# EAGLE design GALI (EAGLE 7.4.0)
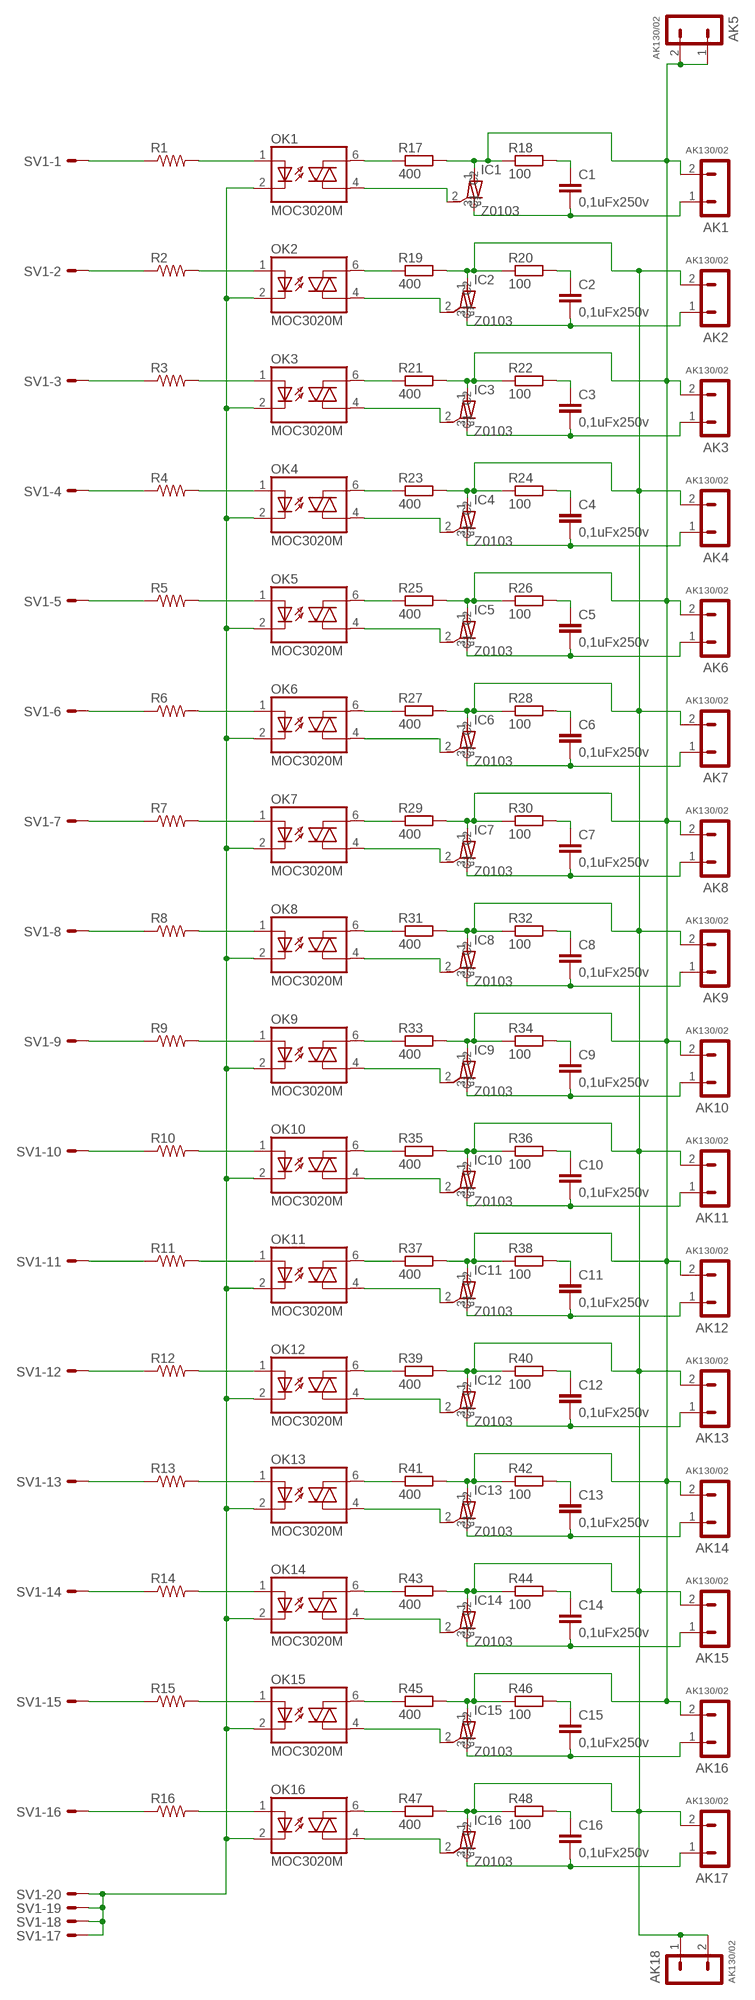
[diagram p0: schematic, sheet 1]

## Parts
AK1  AK130/02  [AK02]
AK2  AK130/02  [AK02]
AK3  AK130/02  [AK02]
AK4  AK130/02  [AK02]
AK5  AK130/02  [AK02]
AK6  AK130/02  [AK02]
AK7  AK130/02  [AK02]
AK8  AK130/02  [AK02]
AK9  AK130/02  [AK02]
AK10  AK130/02  [AK02]
AK11  AK130/02  [AK02]
AK12  AK130/02  [AK02]
AK13  AK130/02  [AK02]
AK14  AK130/02  [AK02]
AK15  AK130/02  [AK02]
AK16  AK130/02  [AK02]
AK17  AK130/02  [AK02]
AK18  AK130/02  [AK02]
C1  0,1uFx250v  C-EU102-054X133  [C102-054X133]
C2  0,1uFx250v  C-EU102-054X133  [C102-054X133]
C3  0,1uFx250v  C-EU102-054X133  [C102-054X133]
C4  0,1uFx250v  C-EU102-054X133  [C102-054X133]
C5  0,1uFx250v  C-EU102-054X133  [C102-054X133]
C6  0,1uFx250v  C-EU102-054X133  [C102-054X133]
C7  0,1uFx250v  C-EU102-054X133  [C102-054X133]
C8  0,1uFx250v  C-EU102-054X133  [C102-054X133]
C9  0,1uFx250v  C-EU102-054X133  [C102-054X133]
C10  0,1uFx250v  C-EU102-054X133  [C102-054X133]
C11  0,1uFx250v  C-EU102-054X133  [C102-054X133]
C12  0,1uFx250v  C-EU102-054X133  [C102-054X133]
C13  0,1uFx250v  C-EU102-054X133  [C102-054X133]
C14  0,1uFx250v  C-EU102-054X133  [C102-054X133]
C15  0,1uFx250v  C-EU102-054X133  [C102-054X133]
C16  0,1uFx250v  C-EU102-054X133  [C102-054X133]
IC1  Z0103  [TO92-]
IC2  Z0103  [TO92-]
IC3  Z0103  [TO92-]
IC4  Z0103  [TO92-]
IC5  Z0103  [TO92-]
IC6  Z0103  [TO92-]
IC7  Z0103  [TO92-]
IC8  Z0103  [TO92-]
IC9  Z0103  [TO92-]
IC10  Z0103  [TO92-]
IC11  Z0103  [TO92-]
IC12  Z0103  [TO92-]
IC13  Z0103  [TO92-]
IC14  Z0103  [TO92-]
IC15  Z0103  [TO92-]
IC16  Z0103  [TO92-]
OK1  MOC3020M  [DIL06]
OK2  MOC3020M  [DIL06]
OK3  MOC3020M  [DIL06]
OK4  MOC3020M  [DIL06]
OK5  MOC3020M  [DIL06]
OK6  MOC3020M  [DIL06]
OK7  MOC3020M  [DIL06]
OK8  MOC3020M  [DIL06]
OK9  MOC3020M  [DIL06]
OK10  MOC3020M  [DIL06]
OK11  MOC3020M  [DIL06]
OK12  MOC3020M  [DIL06]
OK13  MOC3020M  [DIL06]
OK14  MOC3020M  [DIL06]
OK15  MOC3020M  [DIL06]
OK16  MOC3020M  [DIL06]
R1  R-US_0207/12  [0207/12]
R2  R-US_0207/12  [0207/12]
R3  R-US_0207/12  [0207/12]
R4  R-US_0207/12  [0207/12]
R5  R-US_0207/12  [0207/12]
R6  R-US_0207/12  [0207/12]
R7  R-US_0207/12  [0207/12]
R8  R-US_0207/12  [0207/12]
R9  R-US_0207/12  [0207/12]
R10  R-US_0207/12  [0207/12]
R11  R-US_0207/12  [0207/12]
R12  R-US_0207/12  [0207/12]
R13  R-US_0207/12  [0207/12]
R14  R-US_0207/12  [0207/12]
R15  R-US_0207/12  [0207/12]
R16  R-US_0207/12  [0207/12]
R17  400  R-EU_0613/15  [P0613/15]
R18  100  R-EU_0613/15  [P0613/15]
R19  400  R-EU_0613/15  [P0613/15]
R20  100  R-EU_0613/15  [P0613/15]
R21  400  R-EU_0613/15  [P0613/15]
R22  100  R-EU_0613/15  [P0613/15]
R23  400  R-EU_0613/15  [P0613/15]
R24  100  R-EU_0613/15  [P0613/15]
R25  400  R-EU_0613/15  [P0613/15]
R26  100  R-EU_0613/15  [P0613/15]
R27  400  R-EU_0613/15  [P0613/15]
R28  100  R-EU_0613/15  [P0613/15]
R29  400  R-EU_0613/15  [P0613/15]
R30  100  R-EU_0613/15  [P0613/15]
R31  400  R-EU_0613/15  [P0613/15]
R32  100  R-EU_0613/15  [P0613/15]
R33  400  R-EU_0613/15  [P0613/15]
R34  100  R-EU_0613/15  [P0613/15]
R35  400  R-EU_0613/15  [P0613/15]
R36  100  R-EU_0613/15  [P0613/15]
R37  400  R-EU_0613/15  [P0613/15]
R38  100  R-EU_0613/15  [P0613/15]
R39  400  R-EU_0613/15  [P0613/15]
R40  100  R-EU_0613/15  [P0613/15]
R41  400  R-EU_0613/15  [P0613/15]
R42  100  R-EU_0613/15  [P0613/15]
R43  400  R-EU_0613/15  [P0613/15]
R44  100  R-EU_0613/15  [P0613/15]
R45  400  R-EU_0613/15  [P0613/15]
R46  100  R-EU_0613/15  [P0613/15]
R47  400  R-EU_0613/15  [P0613/15]
R48  100  R-EU_0613/15  [P0613/15]
SV1  ML20E  [ML20]

## Nets
N$1: R1.1 SV1.1
N$2: OK2.1(A) R2.2
N$3: OK3.1(A) R3.2
N$4: OK4.1(A) R4.2
N$5: OK5.1(A) R5.2
N$6: OK6.1(A) R6.2
N$7: OK7.1(A) R7.2
N$8: OK8.1(A) R8.2
N$9: OK9.1(A) R9.2
N$10: OK10.1(A) R10.2
N$11: OK11.1(A) R11.2
N$12: OK12.1(A) R12.2
N$13: OK13.1(A) R13.2
N$14: OK14.1(A) R14.2
N$15: OK15.1(A) R15.2
N$16: R2.1 SV1.2
N$17: OK1.2(C) OK2.2(C) OK3.2(C) OK4.2(C) OK5.2(C) OK6.2(C) OK7.2(C) OK8.2(C) OK9.2(C) OK10.2(C) OK11.2(C) OK12.2(C) OK13.2(C) OK14.2(C) OK15.2(C) OK16.2(C) SV1.17 SV1.18 SV1.19 SV1.20
N$18: OK1.1(A) R1.2
N$19: R3.1 SV1.3
N$20: R4.1 SV1.4
N$21: R5.1 SV1.5
N$22: R6.1 SV1.6
N$23: R7.1 SV1.7
N$24: R8.1 SV1.8
N$25: R9.1 SV1.9
N$26: R10.1 SV1.10
N$27: R11.1 SV1.11
N$28: R12.1 SV1.12
N$29: R13.1 SV1.13
N$30: R14.1 SV1.14
N$31: R15.1 SV1.15
N$32: R16.1 SV1.16
N$33: OK16.1(A) R16.2
N$34: OK1.6(A2) R17.1
N$35: OK2.6(A2) R19.1
N$36: OK3.6(A2) R21.1
N$37: OK4.6(A2) R23.1
N$38: OK5.6(A2) R25.1
N$39: OK6.6(A2) R27.1
N$40: OK7.6(A2) R29.1
N$41: OK8.6(A2) R31.1
N$42: OK9.6(A2) R33.1
N$43: OK10.6(A2) R35.1
N$44: OK11.6(A2) R37.1
N$45: OK12.6(A2) R39.1
N$46: OK13.6(A2) R41.1
N$47: OK14.6(A2) R43.1
N$48: OK15.6(A2) R45.1
N$49: OK16.6(A2) R47.1
N$50: C3.1 R22.2
N$51: IC1.2(G) OK1.4(A1)
N$52: C2.1 R20.2
N$53: IC2.2(G) OK2.4(A1)
N$54: C1.1 R18.2
N$55: IC3.2(G) OK3.4(A1)
N$56: C6.1 R28.2
N$57: IC4.2(G) OK4.4(A1)
N$58: C5.1 R26.2
N$59: IC5.2(G) OK5.4(A1)
N$60: C4.1 R24.2
N$61: IC6.2(G) OK6.4(A1)
N$62: C7.1 R30.2
N$63: IC7.2(G) OK7.4(A1)
N$64: C8.1 R32.2
N$65: IC8.2(G) OK8.4(A1)
N$67: IC9.2(G) OK9.4(A1)
N$68: AK1.2 AK3.2 AK5.1 AK5.2 AK6.2 AK8.2 AK10.2 AK12.2 AK14.2 AK16.2 IC1.1(C1) IC3.1(C1) IC5.1(C1) IC7.1(C1) IC9.1(C1) IC11.1(C1) IC13.1(C1) IC15.1(C1) R17.2 R18.1 R21.2 R22.1 R25.2 R26.1 R29.2 R30.1 R33.2 R34.1 R37.2 R38.1 R41.2 R42.1 R45.2 R46.1
N$69: IC10.2(G) OK10.4(A1)
N$71: IC11.2(G) OK11.4(A1)
N$72: C10.1 R36.2
N$73: IC12.2(G) OK12.4(A1)
N$74: C14.1 R44.2
N$75: IC13.2(G) OK13.4(A1)
N$76: C13.1 R42.2
N$77: IC14.2(G) OK14.4(A1)
N$78: C15.1 R46.2
N$79: IC15.2(G) OK15.4(A1)
N$80: C16.1 R48.2
N$81: IC16.2(G) OK16.4(A1)
N$83: AK1.1 C1.2 IC1.3(C2)
N$85: AK2.1 C2.2 IC2.3(C2)
N$87: AK3.1 C3.2 IC3.3(C2)
N$89: AK4.1 C4.2 IC4.3(C2)
N$91: AK6.1 C5.2 IC5.3(C2)
N$93: AK7.1 C6.2 IC6.3(C2)
N$94: C11.1 R38.2
N$95: AK8.1 C7.2 IC7.3(C2)
N$96: C12.1 R40.2
N$97: AK9.1 C8.2 IC8.3(C2)
N$98: C9.1 R34.2
N$99: AK10.1 C9.2 IC9.3(C2)
N$101: AK11.1 C10.2 IC10.3(C2)
N$103: AK12.1 C11.2 IC11.3(C2)
N$105: AK13.1 C12.2 IC12.3(C2)
N$107: AK14.1 C13.2 IC13.3(C2)
N$109: AK15.1 C14.2 IC14.3(C2)
N$111: AK16.1 C15.2 IC15.3(C2)
N$112: AK2.2 AK4.2 AK7.2 AK9.2 AK11.2 AK13.2 AK15.2 AK17.2 AK18.1 AK18.2 IC2.1(C1) IC4.1(C1) IC6.1(C1) IC8.1(C1) IC10.1(C1) IC12.1(C1) IC14.1(C1) IC16.1(C1) R19.2 R20.1 R23.2 R24.1 R27.2 R28.1 R31.2 R32.1 R35.2 R36.1 R39.2 R40.1 R43.2 R44.1 R47.2 R48.1
N$113: AK17.1 C16.2 IC16.3(C2)

## Library data of the parts
AK1-AK18 = ptr_ak130:AK130/02: ANSCHLUSSKLEMME AK130 (2POLIG)
C1-C16 = rcl:C-EU: CAPACITOR, European symbol
IC1-IC16 = Z0103MA triac:Z0103: edit this description Auto generated by make-symbol-device-package-bsdl.ulp Rev. 44 Source:
OK1-OK16 = optocoupler-2:MOC30*M: RANDOM-PHASE OPTOISOLATORS TRIAC DRIVER OUTPUT Source: http://www.fairchildsemi.com MOC3020-M.pdf
R1-R16 = resistor:R-US_: RESISTOR, American symbol
R17-R48 = rcl:R-EU_: RESISTOR, European symbol
SV1 = con-harting-ml:ML20?E: HARTING

## Board
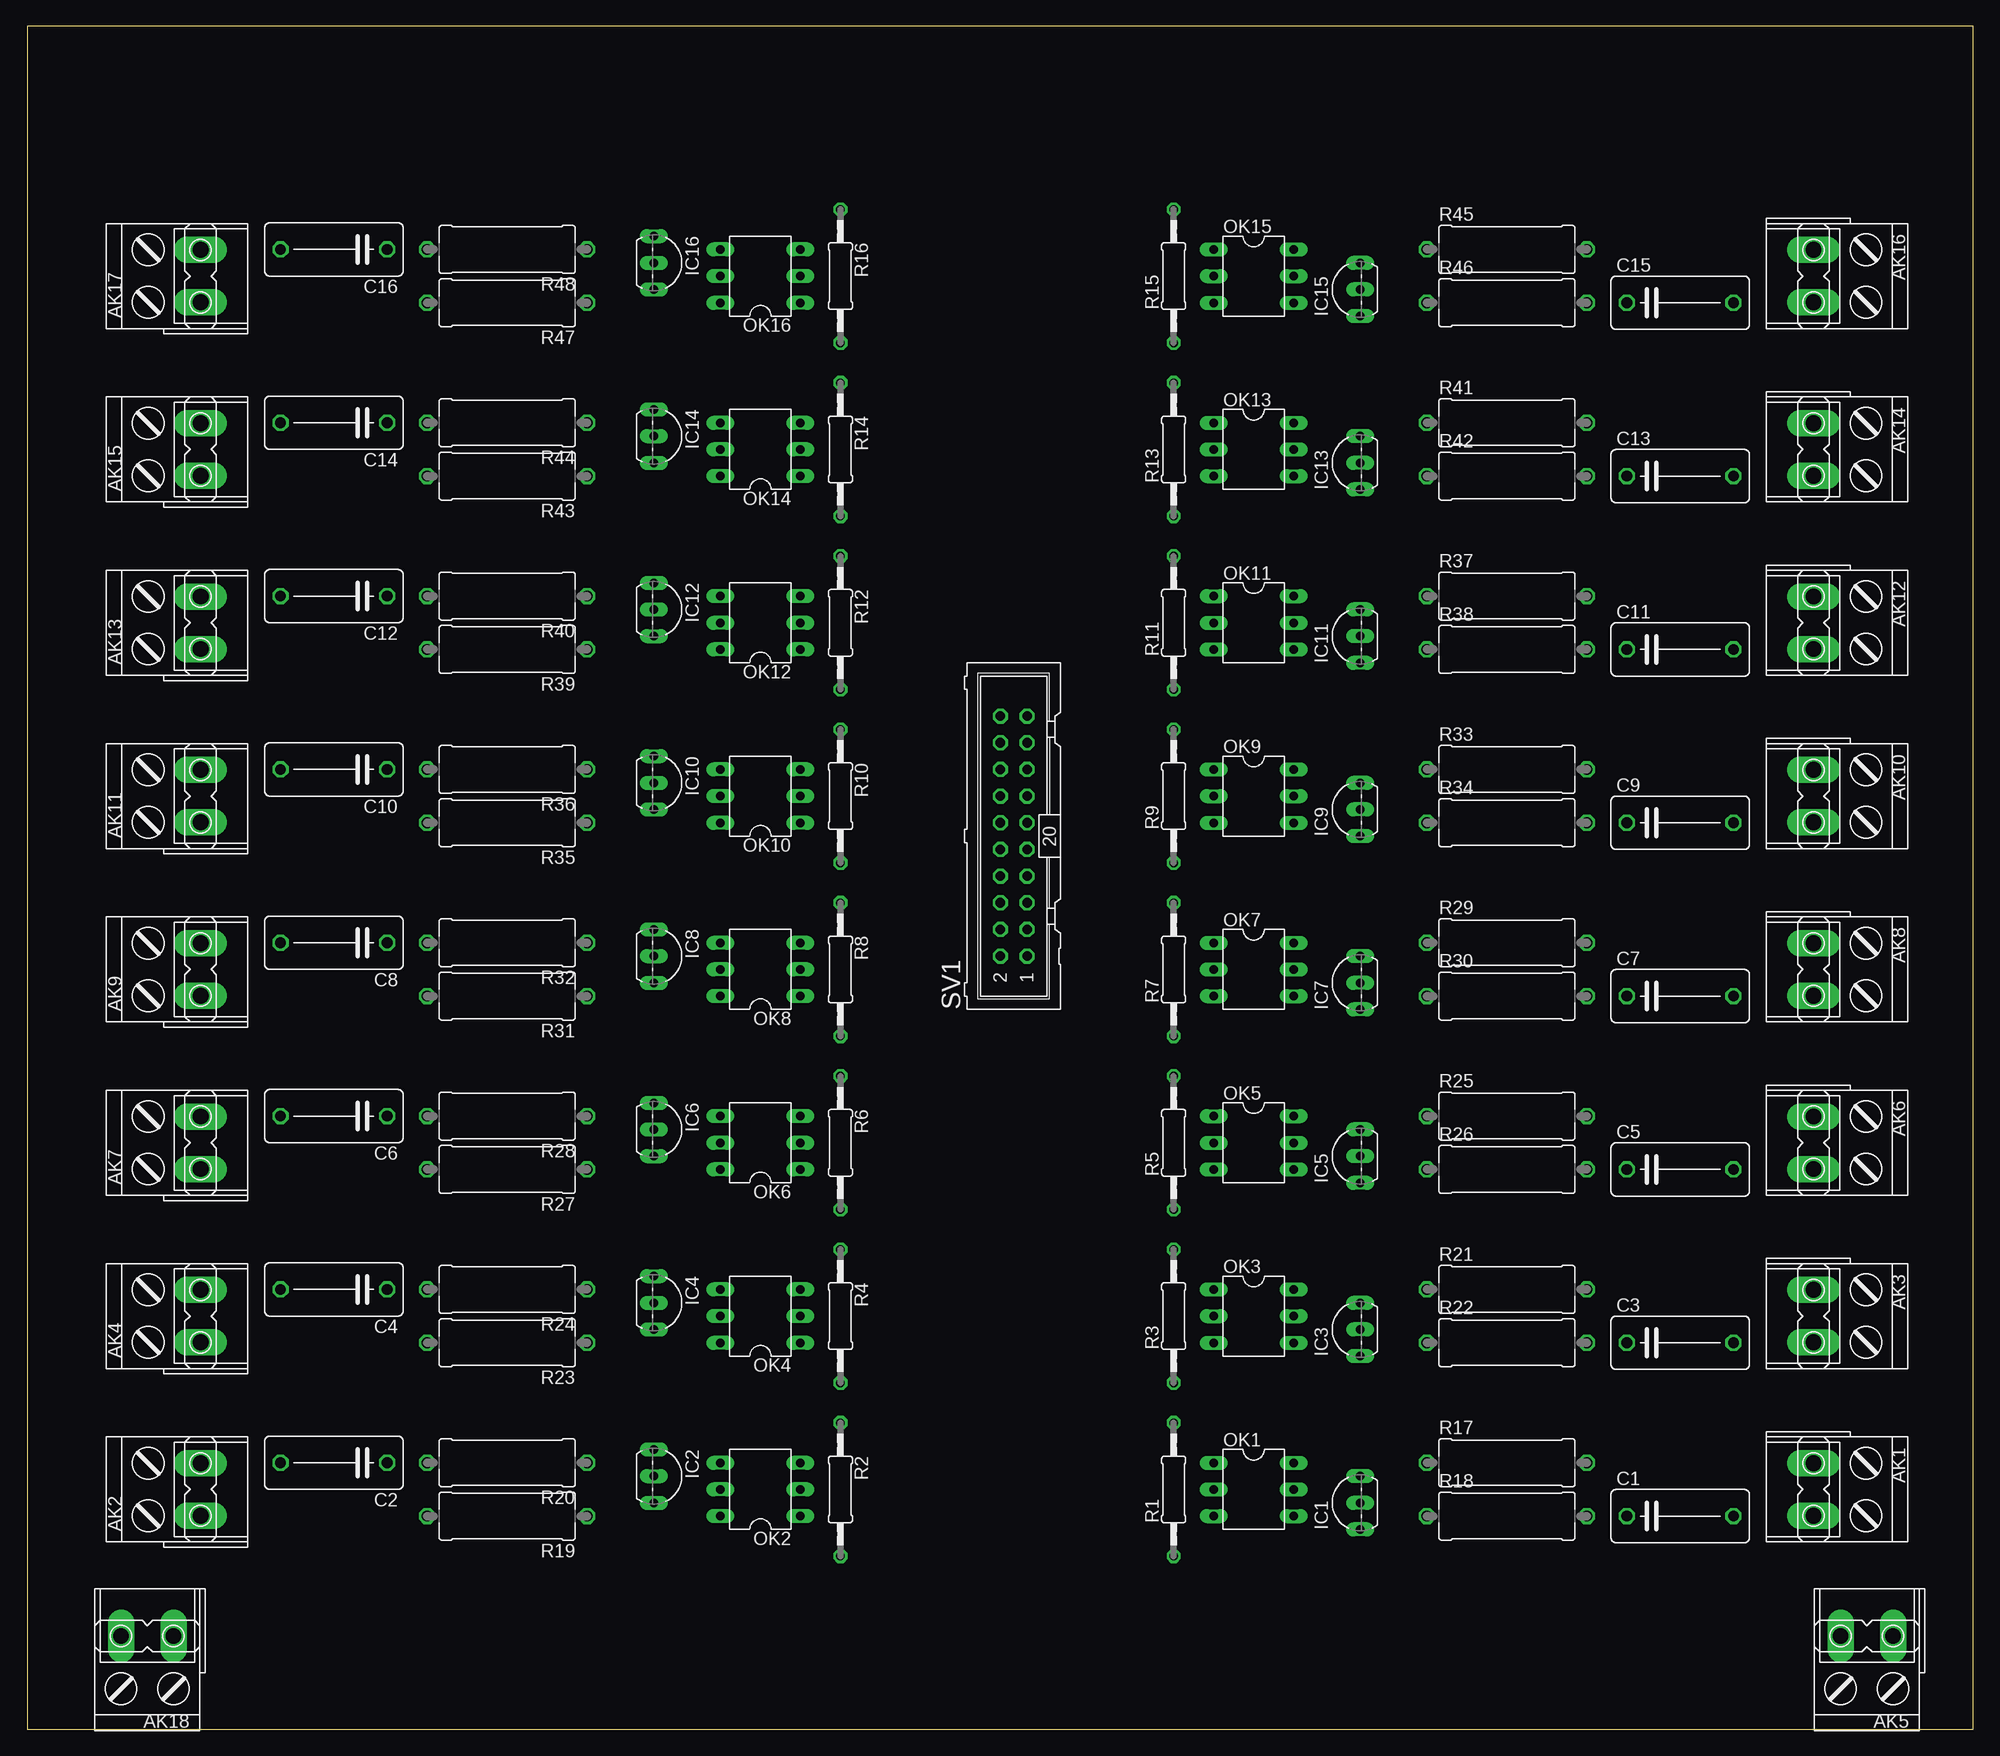
[diagram p1: board, top side]
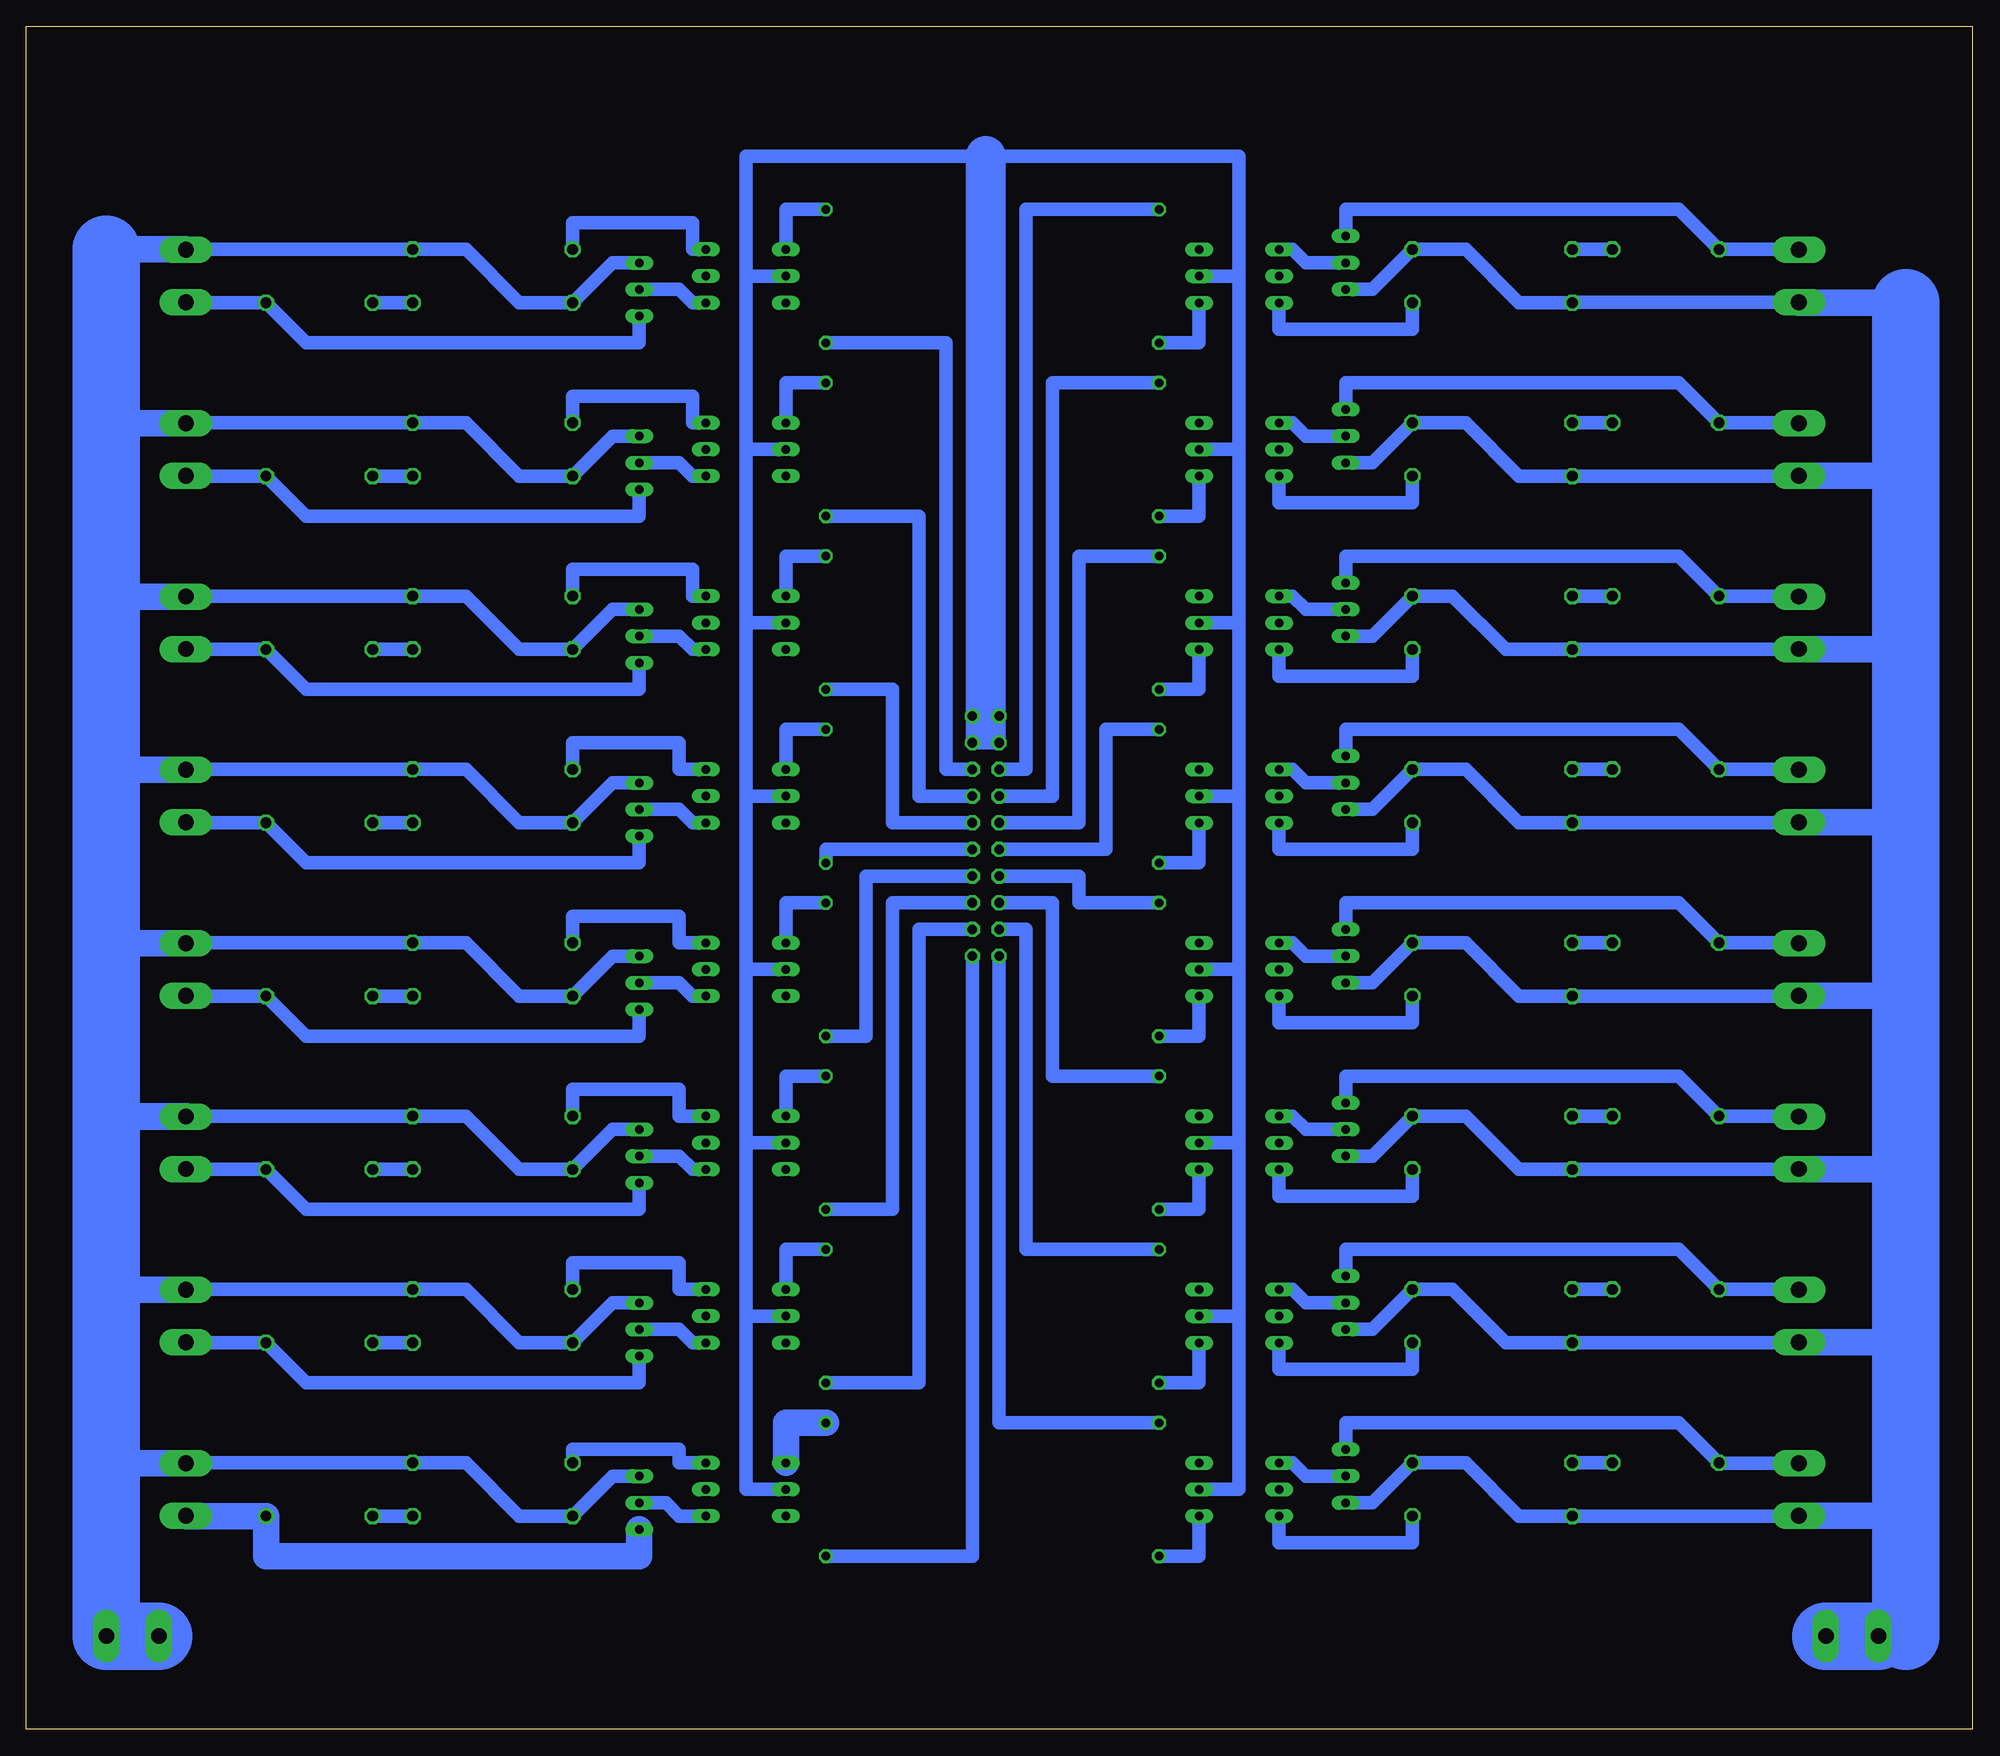
[diagram p2: board, bottom side, seen from below]

Size 185.4 x 162.23 mm. Coordinates in mm from the lower left corner, seen from the top.
Outline: 0,0 185.4,0 185.4,162.23 0,162.23 0,0
Copper layers (1*16): Top 0.035mm / dielectric 1.5mm / Bottom 0.035mm
Design rules "default": minimum track width 10mil, minimum drill 24mil, track to track 8mil, track to pad 8mil, pad to pad 8mil, via to via 8mil, smd to smd 8mil, copper to edge 40mil, drill to drill 8mil, minimum pad ring 10mil, minimum via ring 8mil, stop-mask expansion 4mil, vias tented up to drill 0mil, thermal gap 10mil

### Footprints (pad centres in the part's own frame; a part is rotated, then mirrored left to right if it is on the bottom)
AK02 = drill 1.5 pad 2.54 long: 1 0,2.5; 2 0,-2.5
C102-054X133 = drill 1.016 octagon: 1 -5.08,0; 2 5.08,0
TO92- = drill 0.813 long: 1 2.54,0; 2 0,0; 3 -2.54,0
DIL06 = drill 0.813 long: 1 -2.54,-3.81; 2 0,-3.81; 3 2.54,-3.81; 4 2.54,3.81; 5 0,3.81; 6 -2.54,3.81
0207/12 = drill 0.813 octagon: 1 -6.35,0; 2 6.35,0
P0613/15 = drill 1.016 octagon: 1 -7.62,0; 2 7.62,0
ML20 = drill 0.914 octagon: 1 -11.43,-1.27; 2 -11.43,1.27; 3 -8.89,-1.27; 4 -8.89,1.27; 5 -6.35,-1.27; 6 -6.35,1.27; 7 -3.81,-1.27; 8 -3.81,1.27; 9 -1.27,-1.27; 10 -1.27,1.27; 11 1.27,-1.27; 12 1.27,1.27; 13 3.81,-1.27; 14 3.81,1.27; 15 6.35,-1.27; 16 6.35,1.27; 17 8.89,-1.27; 18 8.89,1.27; 19 11.43,-1.27; 20 11.43,1.27

### Placement (x,y rotation side)
AK1  170.18,22.86 180 top
AK2  16.51,22.86 0 top
AK3  170.18,39.37 180 top
AK4  16.51,39.37 0 top
AK5  175.26,8.89 90 top
AK6  170.18,55.88 180 top
AK7  16.51,55.88 0 top
AK8  170.18,72.39 180 top
AK9  16.51,72.39 0 top
AK10  170.18,88.9 180 top
AK11  16.51,88.9 0 top
AK12  170.18,105.41 180 top
AK13  16.51,105.41 0 top
AK14  170.18,121.92 180 top
AK15  16.51,121.92 0 top
AK16  170.18,138.43 180 top
AK17  16.51,138.43 0 top
AK18  11.43,8.89 90 top
C1  157.48,20.32 0 top
C2  29.21,25.4 180 top
C3  157.48,36.83 0 top
C4  29.21,41.91 180 top
C5  157.48,53.34 0 top
C6  29.21,58.42 180 top
C7  157.48,69.85 0 top
C8  29.21,74.93 180 top
C9  157.48,86.36 0 top
C10  29.21,91.44 180 top
C11  157.48,102.87 0 top
C12  29.21,107.95 180 top
C13  157.48,119.38 0 top
C14  29.21,124.46 180 top
C15  157.48,135.89 0 top
C16  29.21,140.97 180 top
IC1  127,21.59 90 top
IC2  59.69,24.13 270 top
IC3  127,38.1 90 top
IC4  59.69,40.64 270 top
IC5  127,54.61 90 top
IC6  59.69,57.15 270 top
IC7  127,71.12 90 top
IC8  59.69,73.66 270 top
IC9  127,87.63 90 top
IC10  59.69,90.17 270 top
IC11  127,104.14 90 top
IC12  59.69,106.68 270 top
IC13  127,120.65 90 top
IC14  59.69,123.19 270 top
IC15  127,137.16 90 top
IC16  59.69,139.7 270 top
OK1  116.84,22.86 270 top
OK2  69.85,22.86 90 top
OK3  116.84,39.37 270 top
OK4  69.85,39.37 90 top
OK5  116.84,55.88 270 top
OK6  69.85,55.88 90 top
OK7  116.84,72.39 270 top
OK8  69.85,72.39 90 top
OK9  116.84,88.9 270 top
OK10  69.85,88.9 90 top
OK11  116.84,105.41 270 top
OK12  69.85,105.41 90 top
OK13  116.84,121.92 270 top
OK14  69.85,121.92 90 top
OK15  116.84,138.43 270 top
OK16  69.85,138.43 90 top
R1  109.22,22.86 90 top
R2  77.47,22.86 270 top
R3  109.22,39.37 90 top
R4  77.47,39.37 270 top
R5  109.22,55.88 90 top
R6  77.47,55.88 270 top
R7  109.22,72.39 90 top
R8  77.47,72.39 270 top
R9  109.22,88.9 90 top
R10  77.47,88.9 270 top
R11  109.22,105.41 90 top
R12  77.47,105.41 270 top
R13  109.22,121.92 90 top
R14  77.47,121.92 270 top
R15  109.22,138.43 90 top
R16  77.47,138.43 270 top
R17  140.97,25.4 0 top
R18  140.97,20.32 0 top
R19  45.72,20.32 180 top
R20  45.72,25.4 180 top
R21  140.97,41.91 0 top
R22  140.97,36.83 0 top
R23  45.72,36.83 180 top
R24  45.72,41.91 180 top
R25  140.97,58.42 0 top
R26  140.97,53.34 0 top
R27  45.72,53.34 180 top
R28  45.72,58.42 180 top
R29  140.97,74.93 0 top
R30  140.97,69.85 0 top
R31  45.72,69.85 180 top
R32  45.72,74.93 180 top
R33  140.97,91.44 0 top
R34  140.97,86.36 0 top
R35  45.72,86.36 180 top
R36  45.72,91.44 180 top
R37  140.97,107.95 0 top
R38  140.97,102.87 0 top
R39  45.72,102.87 180 top
R40  45.72,107.95 180 top
R41  140.97,124.46 0 top
R42  140.97,119.38 0 top
R43  45.72,119.38 180 top
R44  45.72,124.46 180 top
R45  140.97,140.97 0 top
R46  140.97,135.89 0 top
R47  45.72,135.89 180 top
R48  45.72,140.97 180 top
SV1  93.98,85.09 90 top

### Tracks (layer width: path | path; a pad name or v marks a point on that pad's centre or on a via)
N$1
  Bottom 1.27: SV1.1 95.25,16.51 R1.1
N$2
  Bottom 1.27: OK2.1 73.66,16.51 R2.2
N$3
  Bottom 1.27: R3.2 113.03,45.72 OK3.1
N$4
  Bottom 1.27: OK4.1 73.66,33.02 R4.2
N$5
  Bottom 1.27: R5.2 113.03,62.23 OK5.1
N$6
  Bottom 1.27: OK6.1 73.66,49.53 R6.2
N$7
  Bottom 1.27: R7.2 113.03,78.74 OK7.1
N$8
  Bottom 1.27: OK8.1 73.66,66.04 R8.2
N$9
  Bottom 1.27: R9.2 113.03,95.25 OK9.1
N$10
  Bottom 1.27: OK10.1 73.66,82.55 R10.2
N$11
  Bottom 1.27: R11.2 113.03,111.76 OK11.1
N$12
  Bottom 1.27: OK12.1 73.66,99.06 R12.2
N$13
  Bottom 1.27: R13.2 113.03,128.27 OK13.1
N$14
  Bottom 1.27: OK14.1 73.66,115.57 R14.2
N$15
  Bottom 1.27: R15.2 113.03,144.78 OK15.1
N$16
  Bottom 1.27: SV1.2 92.71,29.21 R2.1
N$17
  Bottom 1.27: SV1.18 SV1.20 SV1.19 SV1.17 SV1.18 | SV1.18 93.98,95.25 | 116.84,138.43 116.84,149.86 93.98,149.86 69.85,149.86 69.85,138.43 | 116.84,138.43 116.84,121.92 | 116.84,121.92 116.84,105.41 | 116.84,105.41 116.84,88.9 | 116.84,88.9 116.84,72.39 | 116.84,72.39 116.84,55.88 | 116.84,55.88 116.84,39.37 | 116.84,39.37 116.84,22.86 OK1.2 | OK3.2 116.84,39.37 | OK5.2 116.84,55.88 | OK7.2 116.84,72.39 | OK9.2 116.84,88.9 | OK11.2 116.84,105.41 | OK13.2 116.84,121.92 | OK15.2 116.84,138.43 | OK2.2 69.85,22.86 69.85,39.37 | 69.85,39.37 69.85,55.88 | 69.85,55.88 69.85,72.39 | 69.85,72.39 69.85,88.9 | 69.85,88.9 69.85,105.41 | 69.85,105.41 69.85,121.92 | 69.85,121.92 69.85,138.43 | OK16.2 69.85,138.43 | OK14.2 69.85,121.92 | OK12.2 69.85,105.41 | OK10.2 69.85,88.9 | OK8.2 69.85,72.39 | OK6.2 69.85,55.88 | OK4.2 69.85,39.37
  Bottom 3.81: 93.98,95.25 93.98,149.86
N$18
  Bottom 2.54: R1.2 113.03,29.21 OK1.1
N$19
  Bottom 1.27: SV1.3 100.33,76.2 100.33,33.02 R3.1
N$20
  Bottom 1.27: SV1.4 90.17,76.2 90.17,45.72 R4.1
N$21
  Bottom 1.27: SV1.5 102.87,78.74 102.87,49.53 R5.1
N$22
  Bottom 1.27: SV1.6 87.63,78.74 87.63,62.23 R6.1
N$23
  Bottom 1.27: SV1.7 105.41,81.28 105.41,66.04 R7.1
N$24
  Bottom 1.27: SV1.8 85.09,81.28 85.09,78.74 R8.1
N$25
  Bottom 1.27: SV1.9 109.22,83.82 R9.1
N$26
  Bottom 1.27: SV1.10 82.55,83.82 82.55,95.25 R10.1
N$27
  Bottom 1.27: SV1.11 102.87,86.36 102.87,99.06 R11.1
N$28
  Bottom 1.27: SV1.12 85.09,86.36 85.09,111.76 R12.1
N$29
  Bottom 1.27: SV1.13 100.33,88.9 100.33,115.57 R13.1
N$30
  Bottom 1.27: SV1.14 87.63,88.9 87.63,128.27 R14.1
N$31
  Bottom 1.27: SV1.15 97.79,91.44 97.79,132.08 R15.1
N$32
  Bottom 1.27: SV1.16 90.17,91.44 90.17,144.78 R16.1
N$33
  Bottom 1.27: OK16.1 73.66,132.08 R16.2
N$34
  Bottom 1.27: OK1.6 123.19,25.4 123.19,26.67 133.35,26.67 R17.1
N$35
  Bottom 1.27: OK2.6 66.04,17.78 53.34,17.78 R19.1
N$36
  Bottom 1.27: OK3.6 123.19,41.91 123.19,44.45 133.35,44.45 R21.1
N$37
  Bottom 1.27: OK4.6 66.04,34.29 53.34,34.29 R23.1
N$38
  Bottom 1.27: OK5.6 123.19,58.42 123.19,60.96 133.35,60.96 R25.1
N$39
  Bottom 1.27: OK6.6 66.04,50.8 53.34,50.8 R27.1
N$40
  Bottom 1.27: OK7.6 123.19,74.93 123.19,77.47 133.35,77.47 R29.1
N$41
  Bottom 1.27: OK8.6 66.04,67.31 53.34,67.31 R31.1
N$42
  Bottom 1.27: OK9.6 123.19,91.44 123.19,93.98 133.35,93.98 R33.1
N$43
  Bottom 1.27: OK10.6 66.04,83.82 53.34,83.82 R35.1
N$44
  Bottom 1.27: OK11.6 121.92,107.95 121.92,110.49 133.35,110.49 R37.1
N$45
  Bottom 1.27: OK12.6 66.04,100.33 53.34,100.33 R39.1
N$46
  Bottom 1.27: OK13.6 121.92,124.46 121.92,127 133.35,127 R41.1
N$47
  Bottom 1.27: OK14.6 66.04,116.84 53.34,116.84 R43.1
N$48
  Bottom 1.27: OK15.6 121.92,140.97 121.92,143.51 133.35,143.51 R45.1
N$49
  Bottom 1.27: OK16.6 66.04,133.35 53.34,133.35 R47.1
N$50
  Bottom 1.27: R22.2 C3.1
N$51
  Bottom 1.27: OK1.4 123.19,20.32 124.46,21.59 IC1.2
N$52
  Bottom 1.27: R20.2 C2.1
N$53
  Bottom 1.27: OK2.4 64.77,25.4 63.5,24.13 IC2.2
N$54
  Bottom 1.27: R18.2 C1.1
N$55
  Bottom 1.27: OK3.4 121.92,36.83 123.19,38.1 IC3.2
N$56
  Bottom 1.27: C6.1 R28.2
N$57
  Bottom 1.27: OK4.4 64.77,41.91 63.5,40.64 IC4.2
N$58
  Bottom 1.27: R26.2 C5.1
N$59
  Bottom 1.27: OK5.4 121.92,53.34 123.19,54.61 IC5.2
N$60
  Bottom 1.27: R24.2 C4.1
N$61
  Bottom 1.27: OK6.4 64.77,58.42 63.5,57.15 IC6.2
N$62
  Bottom 1.27: R30.2 C7.1
N$63
  Bottom 1.27: OK7.4 121.92,69.85 123.19,71.12 IC7.2
N$64
  Bottom 1.27: R32.2 C8.1
N$65
  Bottom 1.27: OK8.4 64.77,74.93 63.5,73.66 IC8.2
N$67
  Bottom 1.27: OK9.4 121.92,86.36 123.19,87.63 IC9.2
N$68
  Bottom 1.27: AK5.1 AK5.2 | 170.22,140.97 AK16.2 170.14,140.97 R45.2 143.51,140.97 138.43,135.89 R46.1 129.54,139.7 IC15.1 | AK1.2 170.14,25.4 R17.2 143.51,25.4 138.43,20.32 R18.1 129.54,24.13 IC1.1 | AK3.2 170.14,41.91 R21.2 143.51,41.91 138.43,36.83 R22.1 129.54,40.64 IC3.1 | AK6.2 170.14,58.42 R25.2 143.51,58.42 138.43,53.34 R26.1 129.54,57.15 IC5.1 | AK8.2 170.14,74.93 R29.2 143.51,74.93 138.43,69.85 R30.1 129.54,73.66 IC7.1 | AK10.2 170.14,91.44 R33.2 143.51,91.44 138.43,86.36 R34.1 129.54,90.17 IC9.1 | AK12.2 170.14,107.95 R37.2 143.51,107.95 138.43,102.87 R38.1 129.54,106.68 IC11.1 | AK14.2 170.14,124.46 R41.2 143.51,124.46 138.43,119.38 R42.1 129.54,123.19 IC13.1
  Bottom 2.54: 177.8,140.97 170.22,140.97 | AK14.2 179.03,124.42 179.07,124.46 177.8,124.46 | AK12.2 177.76,107.91 177.8,107.95 | AK10.2 177.76,91.4 177.8,91.44 | AK8.2 177.76,74.89 177.8,74.93 | AK3.2 177.76,41.87 177.8,41.91 | AK1.2 177.76,25.36 177.8,25.4 | AK6.2 177.76,58.38 177.8,58.42 170.18,58.42 AK6.2
  Bottom 6.452: AK5.1 177.8,8.89 177.8,25.4 177.8,41.91 177.8,58.42 177.8,74.93 177.8,91.44 177.8,107.95 177.8,124.46 177.8,140.97
N$69
  Bottom 1.27: OK10.4 64.77,91.44 63.5,90.17 IC10.2
N$71
  Bottom 1.27: OK11.4 121.92,102.87 123.19,104.14 IC11.2
N$72
  Bottom 1.27: R36.2 C10.1
N$73
  Bottom 1.27: OK12.4 64.77,107.95 63.5,106.68 IC12.2
N$74
  Bottom 1.27: R44.2 C14.1
N$75
  Bottom 1.27: OK13.4 121.92,119.38 123.19,120.65 IC13.2
N$76
  Bottom 1.27: R42.2 C13.1
N$77
  Bottom 1.27: OK14.4 64.77,124.46 63.5,123.19 IC14.2
N$78
  Bottom 1.27: R46.2 C15.1
N$79
  Bottom 1.27: OK15.4 121.92,135.89 123.19,137.16 IC15.2
N$80
  Bottom 1.27: R48.2 C16.1
N$81
  Bottom 1.27: OK16.4 64.77,140.97 63.5,139.7 IC16.2
N$83
  Bottom 2.54: IC1.3 127,16.51 162.56,16.51 C1.2 170.18,20.32 AK1.1
N$85
  Bottom 1.27: AK2.1 24.09,25.36 C2.2 27.94,29.21 59.69,29.21 IC2.3
N$87
  Bottom 1.27: IC3.3 127,33.02 158.75,33.02 C3.2 170.14,36.83 AK3.1
N$89
  Bottom 1.27: IC4.3 59.69,45.72 27.94,45.72 C4.2 16.55,41.91 AK4.1
N$91
  Bottom 1.27: IC5.3 127,49.53 158.75,49.53 C5.2 170.14,53.34 AK6.1
N$93
  Bottom 1.27: IC6.3 59.69,62.23 27.94,62.23 C6.2 16.55,58.42 AK7.1
N$94
  Bottom 1.27: R38.2 C11.1
N$95
  Bottom 1.27: IC7.3 127,66.04 158.75,66.04 C7.2 170.14,69.85 AK8.1
N$96
  Bottom 1.27: R40.2 C12.1
N$97
  Bottom 1.27: IC8.3 59.69,78.74 27.94,78.74 C8.2 16.51,74.93 AK9.1
N$98
  Bottom 1.27: R34.2 C9.1
N$99
  Bottom 1.27: IC9.3 127,82.55 158.75,82.55 C9.2 170.14,86.36 AK10.1
N$101
  Bottom 1.27: IC10.3 59.69,95.25 27.94,95.25 C10.2 16.55,91.44 AK11.1
N$103
  Bottom 1.27: IC11.3 127,99.06 158.75,99.06 C11.2 170.14,102.87 AK12.1
N$105
  Bottom 1.27: IC12.3 59.69,111.76 27.94,111.76 C12.2 16.55,107.95 AK13.1
N$107
  Bottom 1.27: IC13.3 127,115.57 158.75,115.57 C13.2 170.14,119.38 AK14.1
N$109
  Bottom 1.27: IC14.3 59.69,128.27 27.94,128.27 C14.2 16.55,124.46 AK15.1
N$111
  Bottom 1.27: IC15.3 127,132.08 158.75,132.08 C15.2 170.18,135.89 AK16.1
N$112
  Bottom 0.406: AK18.1 6.35,8.89 | 16.51,135.89 AK17.2
  Bottom 1.27: AK17.2 38.06,135.93 R47.2 43.18,135.89 48.26,140.97 R48.1 57.15,137.16 IC16.1 | IC14.1 57.15,120.65 R44.1 48.26,124.46 43.18,119.38 R43.2 16.55,119.38 AK15.2 | AK13.2 16.55,102.87 R39.2 44.45,102.87 49.53,107.95 R40.1 57.15,104.14 IC12.1 | AK11.2 16.55,86.36 R35.2 43.18,86.36 48.26,91.44 R36.1 57.15,87.63 IC10.1 | AK9.2 16.55,69.85 R31.2 43.18,69.85 48.26,74.93 R32.1 57.15,71.12 IC8.1 | AK7.2 16.55,53.34 R27.2 43.18,53.34 48.26,58.42 R28.1 57.15,54.61 IC6.1 | AK4.2 16.55,36.83 R23.2 44.45,36.83 49.53,41.91 R24.1 57.15,38.1 IC4.1 | AK2.2 16.55,20.32 R19.2 43.18,20.32 48.26,25.4 R20.1 57.15,21.59 IC2.1
  Bottom 2.54: 6.35,135.89 16.51,135.89 | AK15.2 6.35,119.42 6.35,119.38 | AK13.2 6.35,102.91 6.35,102.87 | AK11.2 6.35,86.4 6.35,86.36 | AK9.2 6.35,69.89 6.35,69.85 | AK7.2 6.35,53.38 6.35,53.34 | AK4.2 6.35,36.87 6.35,36.83 | AK2.2 6.35,20.36 6.35,20.32
  Bottom 6.452: AK18.2 AK18.1 | 6.35,8.89 6.35,20.32 6.35,36.83 6.35,53.34 6.35,69.85 6.35,86.36 6.35,102.87 6.35,119.38 6.35,135.89
N$113
  Bottom 1.27: IC16.3 59.69,144.78 27.94,144.78 C16.2 16.55,140.97 AK17.1